# Altium schematic sheet adc.SchDoc: A 24-bit AD7714YRZ Analog-to-Digital Converter
size A4; PageSetup: Record=PageOptions|CenterHorizontal=True|CenterVertical=True|PrintScale=1.00|XCorrection=1.00|YCorrection=1.00|PrintKind=0|BorderSize=5000000|LeftOffset=0|BottomOffset=0|Orientation=2|PaperLength=1000|PaperWidth=1000|Scale=100|PaperSource=7|PrintQuality=-3|MediaType=1|DitherType=10|PrintScaleMode=1|PaperKind=A4|PaperIndex=9
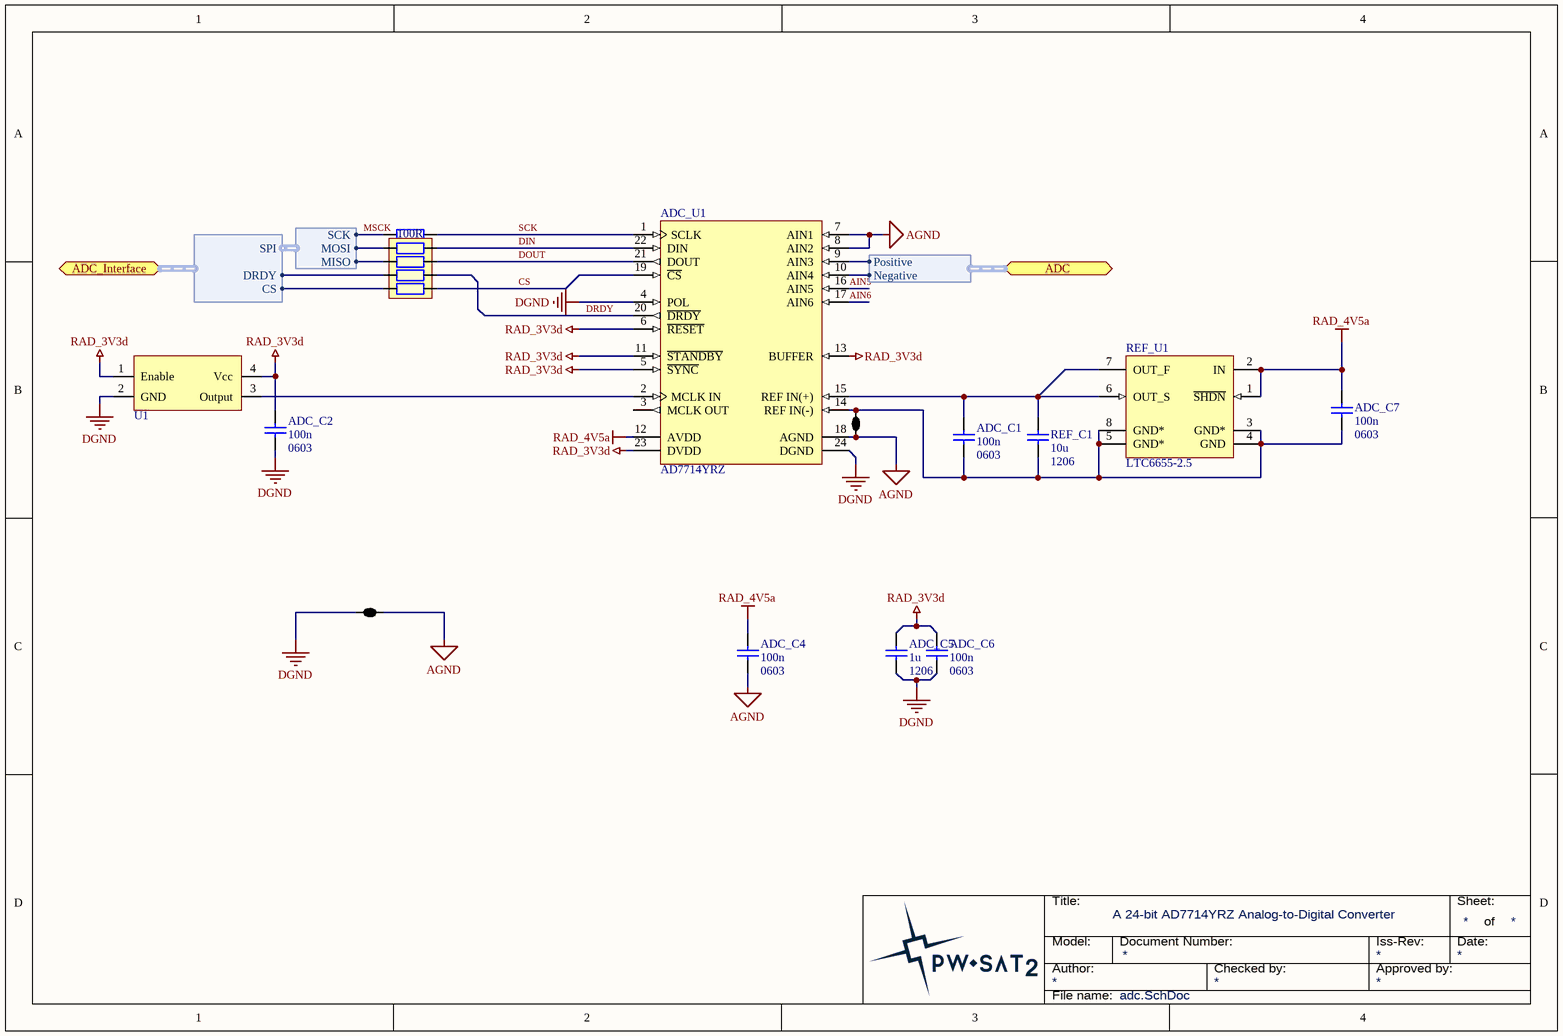
[diagram p0: adc.SchDoc]

## Parts
ADC_C1  value 100n  Package: 0603  [SMD_Capacitor_0603]  (hidden comment: Cap)
ADC_C2  value 100n  Package: 0603  [SMD_Capacitor_0603]  (hidden comment: Cap)
ADC_C4  value 100n  Package: 0603  [SMD_Capacitor_0603]  (hidden comment: Cap)
ADC_C5  value 1u  Package: 1206  [SMD_Capacitor_1206]  (hidden comment: Cap)
ADC_C6  value 100n  Package: 0603  [SMD_Capacitor_0603]  (hidden comment: Cap)
ADC_C7  value 100n  Package: 0603  [SMD_Capacitor_0603]  (hidden comment: Cap)
ADC_J1  2 way net tie junction  [2way_LP]  (value not drawn)  (net tie, no BOM)
ADC_J2  2 way net tie junction  [2way_LP]  (value not drawn)  (net tie, no BOM)
ADC_R1  100R  [SMD_Resistor_0603]
ADC_R2  YC124-JR-072K2L  [SMD_RESISTOR_ARRAY_YC124]  (value not drawn)
ADC_U1  AD7714YRZ  [TSSOP-24-RU-24-N]
REF_C1  value 10u  Package: 1206  [SMD_Capacitor_1206]  (hidden comment: Cap)
REF_U1  LTC6655-2.5  [MSOP-8]
U1  Ceramic Crystal  [2.0 x 2.5 mm]  (value not drawn)

## Ports
ADC (harness ADC Channel), ADC_Interface (harness ADC_DIGITAL)

## Harnesses
ADC_DIGITAL: DRDY, CS, SPI
SPI: SCK, MOSI, MISO
ADC Channel: Positive, Negative

## Nets
AGND: ADC_C4.2 ADC_J1.1 ADC_J2.1 ADC_U1.7(AIN1) ADC_U1.8(AIN2) ADC_U1.18(AGND)
DGND: ADC_C2.2 ADC_C5.2 ADC_C6.2 ADC_J1.2 ADC_U1.4(POL) ADC_U1.24(DGND) U1.2(GND)
RAD_3V3d: ADC_C2.1 ADC_C5.1 ADC_C6.1 ADC_U1.5(~{SYNC}) ADC_U1.6(~{RESET}) ADC_U1.11(~{STANDBY}) ADC_U1.13(BUFFER) ADC_U1.23(DVDD) U1.1(Enable) U1.4(Vcc)
RAD_4V5a: ADC_C4.1 ADC_C7.1 ADC_U1.12(AVDD) REF_U1.1(~{SHDN}) REF_U1.2(IN)
AIN5: ADC_U1.16(AIN5)
AIN6: ADC_U1.17(AIN6)
CS: ADC_R2.4 ADC_U1.19(~{CS})
DIN: ADC_R2.1 ADC_U1.22(DIN)
DOUT: ADC_R2.2 ADC_U1.21(DOUT)
DRDY: ADC_R2.3 ADC_U1.20(~{DRDY})
MSCK: ADC_R1.1 ; harness SPI.SCK
SCK: ADC_R1.2 ADC_U1.1(SCLK)
NetADC_C1_1: ADC_C1.1 ADC_U1.15(REF_IN(+)) REF_C1.1 REF_U1.6(OUT_S) REF_U1.7(OUT_F)
NetADC_C1_2: ADC_C1.2 ADC_C7.2 ADC_J2.2 ADC_U1.14(REF_IN(-)) REF_C1.2 REF_U1.3(GND*) REF_U1.4(GND) REF_U1.5(GND*) REF_U1.8(GND*)
NetADC_R2_5: ADC_R2.5 ; port ADC_Interface.CS
NetADC_R2_6: ADC_R2.6 ; port ADC_Interface.DRDY
NetADC_R2_7: ADC_R2.7 ; harness SPI.MISO
NetADC_R2_8: ADC_R2.8 ; harness SPI.MOSI
NetADC_U1_2: ADC_U1.2(MCLK_IN) U1.3(Output)
NetADC_U1_9: ADC_U1.9(AIN3) ; port ADC.Positive
NetADC_U1_10: ADC_U1.10(AIN4) ; port ADC.Negative

Not connected (* = marked no-connect by the designer): ADC_U1 3(MCLK_OUT)

## Notes on the sheet
- Title:
- Sheet:
- of
- Author:
- Model:
- Document Number:
- Checked by:
- Iss-Rev:
- Approved by:
- Date:
- File name:

## Library data of the parts
ADC_J1 ADC_J2 = 2way: ComponentLink1URL: http://www.edatools.cz/addons; ComponentLink1Description: Source; FootprintNote: LP=12mil, MP=40mil, HP=120mil
ADC_R1 = Res: Value: 100R; Package: 0603
ADC_R2 = YC124-JR-072K2L: RESISTOR ARRAY, 4 x 0402; URL: http://pl.farnell.com/yageo-phycomp/yc124-jr-072k2l/resistor-array-arv341-4-x-0402/dp/9235388
ADC_U1 = AD7714YRZ: 5 Channel 24-Bit Signal Conditioning Analog-to-Digital Converter with Serial, SPI Interface, 500 uA, CMOS, 3 V / 5 V, 1KSPS, -40 to +105 degC, RW-24, Pb-Free, Tube; Generic Part Number: AD7714; Manufacturer: Analog Devices; Resolution (Bits): 24; Channels: 5; Throughput Rate (SPS): 1K; Interface: Ser, SPI; DatasheetVersion: Rev.C; PackageVersion: 060706-A; PackageReference: RW-24; PackageDescription: 24-Lead Standard Small Outline Package [SOIC_W]; Supplier 1: Digi-Key; Supplier Part Number 1: AD7714YRZ-ND; Supplier 2: Farnell; Supplier Part Number 2: 1438858; Supplier 3: Newark; Supplier Part Number 3: 15P0854; Supplier 4: Newark; Supplier Part Number 4: 59K5335; Supplier 5: Mouser; Supplier Part Number 5: 584-AD7714YRZ; RoHS: Y; Packing: Tube; Mounting Technology: Surface Mount; Code_JEDEC: MS-013-AD; PartNumber: AD7714YRZ; ComponentLink1Description: Manufacturer URL; ComponentLink1URL: http://www.analog.com/en/index.html; ComponentLink2Description: Datasheet; ComponentLink2URL: http://www.analog.com/static/imported-files/data_sheets/AD7714.pdf; ComponentLink3Description: Package Specification; ComponentLink3URL: http://www.analog.com/static/imported-files/packages/33665150946139RW_24.pdf; ComponentLink4Description: Product URL; ComponentLink4URL: http://www.analog.com/en/analog-to-digital-converters/ad-converters/ad7714/products/product.html
REF_U1 = LTC6655-2.5: 0.25ppm Noise, Low Drift  Precision References; PartNumber: LTC6655-2.5; ComponentLink1Description: Manufacturer URL; ComponentLink1URL: http://www.linear.com/; ComponentLink2Description: Datasheet; ComponentLink2URL: http://cds.linear.com/docs/en/datasheet/6655fe.pdf
U1 = ISM95-3351AH-1.0000: Ceramic Crystal 1 MHz, A-Grade 25 ppm/deg